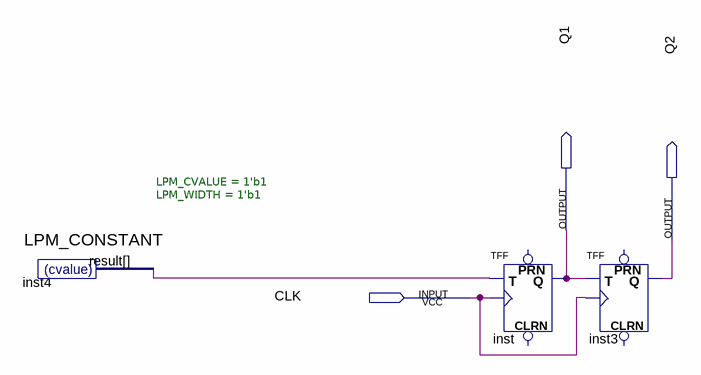
[diagram p0: schematic sheet]
// Quartus schematic 2bit_counter.bdf as structural Verilog: 3 symbols, 3 pins
module \2bit_counter  (
  input  CLK,
  output Q1,
  output Q2
);

  wire inst4_result;

  LPM_CONSTANT #(.LPM_CVALUE(1'b1), .LPM_WIDTH(1'b1)) inst4 (.result(inst4_result));
  TFF inst (.T(inst4_result), .CLK(CLK), .Q(Q1));  // open: PRN, CLRN
  TFF inst3 (.T(Q1), .CLK(CLK), .Q(Q2));  // open: PRN, CLRN
endmodule
